# Altium project RS2-708_V010.PrjPCB (part 2 of 6)

## Sheet KSZ8795CLX.SchDoc
size A4
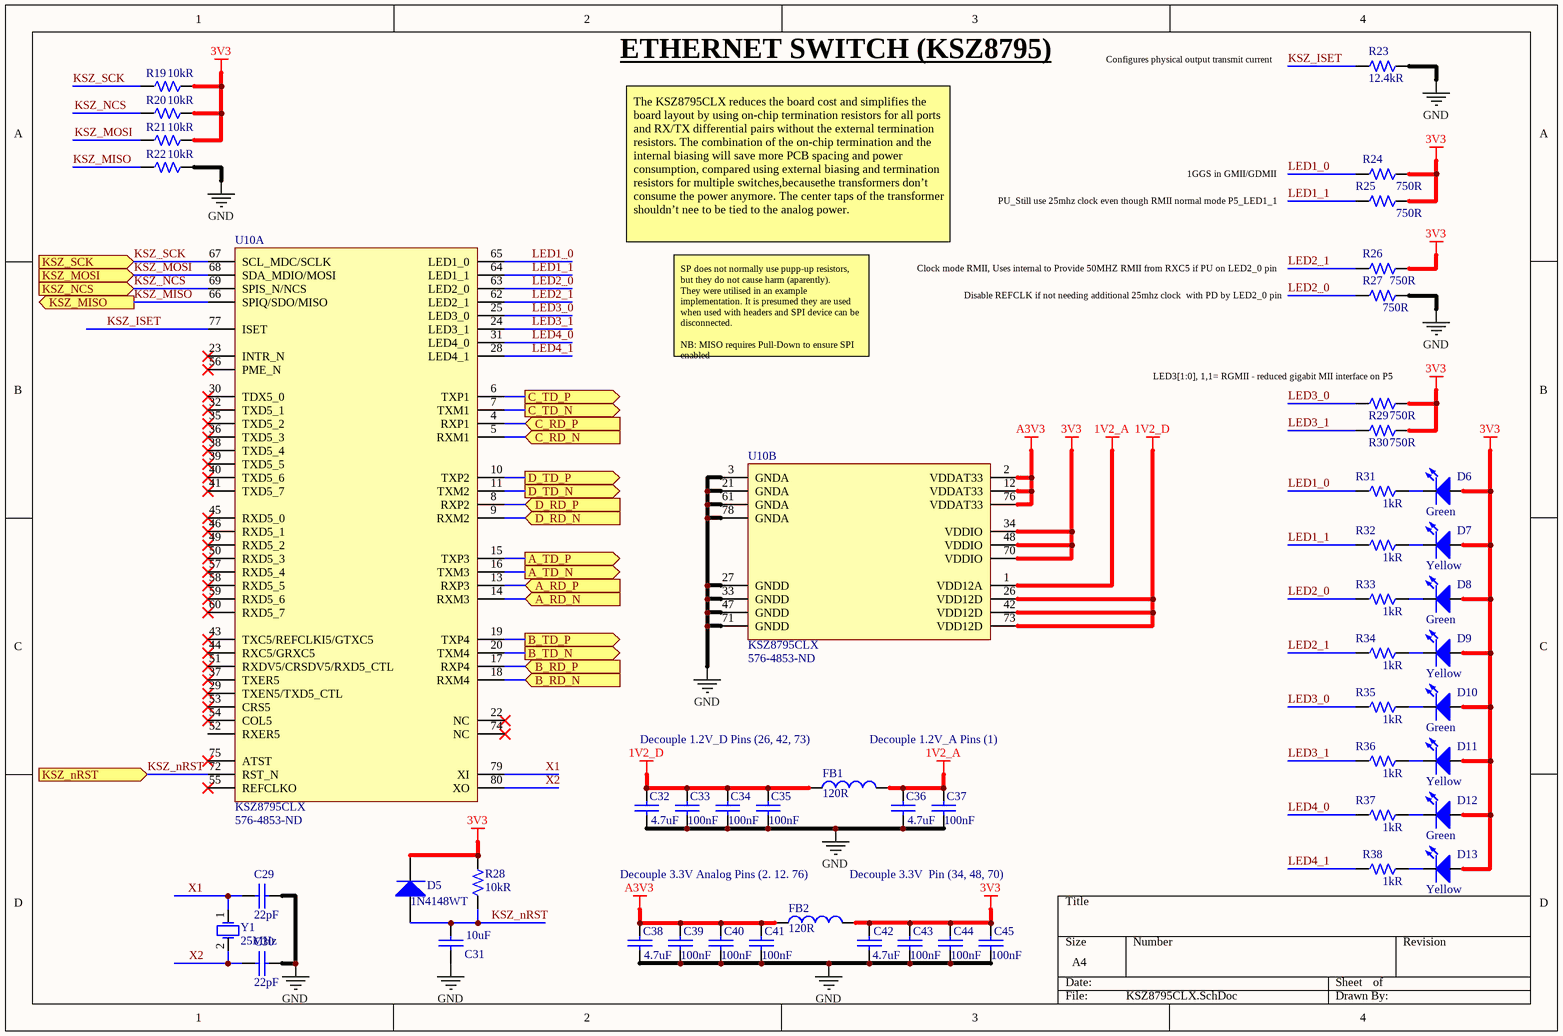
[diagram p2: KSZ8795CLX.SchDoc]

### Parts
C29  Capacitance: 22pF  [CAP0402]  (hidden comment: Capacitor)
C30  Capacitance: 22pF  [CAP0402]  (hidden comment: Capacitor)
C31  value 10uF  [CAP0603]  (hidden comment: Capacitor)
C32  Capacitance: 4.7uF  [CAP0402]  (hidden comment: Capacitor)
C33  Capacitance: 100nF  [CAP0402]  (hidden comment: Capacitor)
C34  Capacitance: 100nF  [CAP0402]  (hidden comment: Capacitor)
C35  Capacitance: 100nF  [CAP0402]  (hidden comment: Capacitor)
C36  Capacitance: 4.7uF  [CAP0402]  (hidden comment: Capacitor)
C37  Capacitance: 100nF  [CAP0402]  (hidden comment: Capacitor)
C38  Capacitance: 4.7uF  [CAP0402]  (hidden comment: Capacitor)
C39  Capacitance: 100nF  [CAP0402]  (hidden comment: Capacitor)
C40  Capacitance: 100nF  [CAP0402]  (hidden comment: Capacitor)
C41  Capacitance: 100nF  [CAP0402]  (hidden comment: Capacitor)
C42  Capacitance: 4.7uF  [CAP0402]  (hidden comment: Capacitor)
C43  Capacitance: 100nF  [CAP0402]  (hidden comment: Capacitor)
C44  Capacitance: 100nF  [CAP0402]  (hidden comment: Capacitor)
C45  Capacitance: 100nF  [CAP0402]  (hidden comment: Capacitor)
D5  Manufacturer Part Number 1: 1N4148WT  [SOD523]  (hidden comment: Diode)
D6  Color: Green  [LED-0603-GREEN]  (hidden comment: LED)
D7  Color: Yellow  [LED-0603-YELLOW]  (hidden comment: LED)
D8  Color: Green  [LED-0603-GREEN]  (hidden comment: LED)
D9  Color: Yellow  [LED-0603-YELLOW]  (hidden comment: LED)
D10  Color: Green  [LED-0603-GREEN]  (hidden comment: LED)
D11  Color: Yellow  [LED-0603-YELLOW]  (hidden comment: LED)
D12  Color: Green  [LED-0603-GREEN]  (hidden comment: LED)
D13  Color: Yellow  [LED-0603-YELLOW]  (hidden comment: LED)
FB1  Impedance: 120R  [RES0402]  (hidden comment: Ferrite Bead)
FB2  Impedance: 120R  [RES0402]  (hidden comment: Ferrite Bead)
R19  Resistance: 10kR  [RES0402]  (hidden comment: Resistor)
R20  Resistance: 10kR  [RES0402]  (hidden comment: Resistor)
R21  Resistance: 10kR  [RES0402]  (hidden comment: Resistor)
R22  Resistance: 10kR  [RES0402]  (hidden comment: Resistor)
R23  Resistance: 12.4kR  [RES0402]  (hidden comment: Resistor)
R24  Resistance: 750R  [RES0402]  (hidden comment: Resistor)
R25  Resistance: 750R  [RES0402]  (hidden comment: Resistor)
R26  Resistance: 750R  [RES0402]  (hidden comment: Resistor)
R27  Resistance: 750R  [RES0402]  (hidden comment: Resistor)
R28  Resistance: 10kR  [RES0402]  (hidden comment: Resistor)
R29  Resistance: 750R  [RES0402]  (hidden comment: Resistor)
R30  Resistance: 750R  [RES0402]  (hidden comment: Resistor)
R31  Resistance: 1kR  [RES0402]  (hidden comment: Resistor)
R32  Resistance: 1kR  [RES0402]  (hidden comment: Resistor)
R33  Resistance: 1kR  [RES0402]  (hidden comment: Resistor)
R34  Resistance: 1kR  [RES0402]  (hidden comment: Resistor)
R35  Resistance: 1kR  [RES0402]  (hidden comment: Resistor)
R36  Resistance: 1kR  [RES0402]  (hidden comment: Resistor)
R37  Resistance: 1kR  [RES0402]  (hidden comment: Resistor)
R38  Resistance: 1kR  [RES0402]  (hidden comment: Resistor)
U10  KSZ8795CLX  Supplier Part Number 1: 576-4853-ND  [KSZ8795CLX]  (parts A,B of 2)
Y1  Frequency: 25MHz  [ABM7 Oscillator]  (hidden comment: Osc)

### Ports
A_RD_N (in), A_RD_P (in), A_TD_N (out), A_TD_P (out), B_RD_N (in), B_RD_P (in), B_TD_N (out), B_TD_P (out), C_RD_N (in), C_RD_P (in), C_TD_N (out), C_TD_P (out), D_RD_N (in), D_RD_P (in), D_TD_N (out), D_TD_P (out), KSZ_MISO (out), KSZ_MOSI (in), KSZ_NCS (in), KSZ_nRST (in), KSZ_SCK (in)

### Nets
1V2_A: C36.1 C37.1 FB1.2 U10.1(VDD12A)
1V2_D: C32.1 C33.1 C34.1 C35.1 FB1.1 U10.26(VDD12D) U10.42(VDD12D) U10.73(VDD12D)
3V3: C42.1 C43.1 C44.1 C45.1 D5.1 D6.2 D7.2 D8.2 D9.2 D10.2 D11.2 D12.2 D13.2 FB2.2 R19.2 R20.2 R21.2 R24.2 R25.2 R26.2 R28.1 R29.2 R30.2 U10.34(VDDIO) U10.48(VDDIO) U10.70(VDDIO)
A3V3: C38.1 C39.1 C40.1 C41.1 FB2.1 U10.2(VDDAT33) U10.12(VDDAT33) U10.76(VDDAT33)
GND: C29.2 C30.2 C31.2 C32.2 C33.2 C34.2 C35.2 C36.2 C37.2 C38.2 C39.2 C40.2 C41.2 C42.2 C43.2 C44.2 C45.2 R22.2 R23.1 R27.2 U10.3(GNDA) U10.21(GNDA) U10.27(GNDD) U10.33(GNDD) U10.47(GNDD) U10.61(GNDA) U10.71(GNDD) U10.78(GNDA)
A_RD_N: U10.14(RXM3) ; port A_RD_N
A_RD_P: U10.13(RXP3) ; port A_RD_P
A_TD_N: U10.16(TXM3) ; port A_TD_N
A_TD_P: U10.15(TXP3) ; port A_TD_P
B_RD_N: U10.18(RXM4) ; port B_RD_N
B_RD_P: U10.17(RXP4) ; port B_RD_P
B_TD_N: U10.20(TXM4) ; port B_TD_N
B_TD_P: U10.19(TXP4) ; port B_TD_P
C_RD_N: U10.5(RXM1) ; port C_RD_N
C_RD_P: U10.4(RXP1) ; port C_RD_P
C_TD_N: U10.7(TXM1) ; port C_TD_N
C_TD_P: U10.6(TXP1) ; port C_TD_P
D_RD_N: U10.9(RXM2) ; port D_RD_N
D_RD_P: U10.8(RXP2) ; port D_RD_P
D_TD_N: U10.11(TXM2) ; port D_TD_N
D_TD_P: U10.10(TXP2) ; port D_TD_P
KSZ_ISET: R23.2 U10.77(ISET)
KSZ_MISO: R22.1 U10.66(SPIQ/SDO/MISO) ; port KSZ_MISO
KSZ_MOSI: R21.1 U10.68(SDA_MDIO/MOSI) ; port KSZ_MOSI
KSZ_NCS: R20.1 U10.69(SPIS_N/NCS) ; port KSZ_NCS
KSZ_nRST: C31.1 D5.2 R28.2 U10.72(RST_N) ; port KSZ_nRST
KSZ_SCK: R19.1 U10.67(SCL_MDC/SCLK) ; port KSZ_SCK
LED1_0: R24.1 R31.1 U10.65(LED1_0)
LED1_1: R25.1 R32.1 U10.64(LED1_1)
LED2_0: R27.1 R33.1 U10.63(LED2_0)
LED2_1: R26.1 R34.1 U10.62(LED2_1)
LED3_0: R29.1 R35.1 U10.25(LED3_0)
LED3_1: R30.1 R36.1 U10.24(LED3_1)
LED4_0: R37.1 U10.31(LED4_0)
LED4_1: R38.1 U10.28(LED4_1)
X1: C29.1 U10.79(XI) Y1.1
X2: C30.1 U10.80(XO) Y1.2
NetD6_1: D6.1 R31.2
NetD7_1: D7.1 R32.2
NetD8_1: D8.1 R33.2
NetD9_1: D9.1 R34.2
NetD10_1: D10.1 R35.2
NetD11_1: D11.1 R36.2
NetD12_1: D12.1 R37.2
NetD13_1: D13.1 R38.2

Not connected (* = marked no-connect by the designer): U10 22(NC)* 23(INTR_N)* 29(TXEN5/TXD5_CTL)* 30(TDX5_0)* 32(TXD5_1)* 35(TXD5_2)* 36(TXD5_3)* 37(TXER5)* 38(TXD5_4)* 39(TXD5_5)* 40(TXD5_6)* 41(TXD5_7)* 43(TXC5/REFCLKI5/GTXC5)* 44(RXC5/GRXC5)* 45(RXD5_0)* 46(RXD5_1)* 49(RXD5_2)* 50(RXD5_3)* 51(RXDV5/CRSDV5/RXD5_CTL)* 52(RXER5) 53(CRS5)* 54(COL5)* 55(REFCLKO)* 56(PME_N)* 57(RXD5_4)* 58(RXD5_5)* 59(RXD5_6)* 60(RXD5_7)* 74(NC)* 75(ATST)*

### Notes on the sheet
- ETHERNET SWITCH (KSZ8795)
- Configures physical output transmit current
- 1GGS in GMII/GDMII
- The KSZ8795CLX reduces the board cost and simplifies the board layout by using on-chip termination resistors for all ports and RX/TX differential pairs without the external termination resistors. The combination of the on-chip termination and the internal biasing will save more PCB spacing and power consumption, compared using external biasing and termination resistors for multiple switches,becausethe transformers don’t consume the power anymore. The center taps of the transformer shouldn’t nee to be tied to the analog power.
- PU_Still use 25mhz clock even though RMII normal mode P5_LED1_1
- Clock mode RMII, Uses internal to Provide 50MHZ RMII from RXC5 if PU on LED2_0 pin
- Disable REFCLK if not needing additional 25mhz clock  with PD by LED2_0 pin
- SP does not normally use pupp-up resistors, but they do not cause harm (aparently).
  They were utilised in an example implementation. It is presumed they are used when used with headers and SPI device can be disconnected.
  NB: MISO requires Pull-Down to ensure SPI enabled
- (near R29) LED3[1:0], 1,1= RGMII - reduced gigabit MII interface on P5
- Decouple 1.2V_D Pins (26, 42, 73)
- Decouple 1.2V_A Pins (1)
- Decouple 3.3V Analog Pins (2. 12. 76)
- Decouple 3.3V  Pin (34, 48, 70)

### Library data of the parts
C29 C30 = Capacitor: Manufacturer 1: Murata; Manufacturer Part Number 1: GRM1555C1H220FA01D; Material: Ceramic; Voltage Rating: 50V; Dielectric: C0G; Manufacturer: *; Manufacturer Part Number: *; Supplier: *; Supplier Part Number: *; Tolerance: *; Voltage: *; Footprint: *; Temperature Coefficient: *; Supplier 1: Digi-Key; Supplier Part Number 1: 490-8589-1-ND; Stock 1: 1227141; Pricing 1: 1=0,10000, 10=0,07400, 100=0,03290, 500=0,02348, 1000=0,01845, 2500=0,01678, 5000=0,01543 (USD); RoHS: Yes; Mount: Surface Mount; Case/Package: 0402; Case Code (Imperial): 0402; Case Code (Metric): 1005; Min Operating Temperature: -55°C; Max Operating Temperature: 125°C; Voltage Rating (DC): 50V; Packaging: Tape and Reel; Package Quantity: 1; Termination: SMD/SMT; Length: 1mm; Height: 0.5mm; Width: 0.5mm; Thickness: 0.022inch; Depth: 0.5mm; Radiation Hardening: No; Lead Free: Lead Free; REACH SVHC: No SVHC; ComponentLink1URL: https://datasheet.ciiva.com/11789/0900766b80ef921d-11789137.pdf?src-supplier=RSComponents; ComponentLink1Description: https://datasheet.ciiva.com/11789/0900766b80ef921d-11789137.pdf?src-supplier=RSComponents; ComponentLink2URL: https://datasheet.ciiva.com/29536/partnumbering-e-01-29536087.pdf?src-supplier=Digi-Key; ComponentLink2Description: https://datasheet.ciiva.com/29536/partnumbering-e-01-29536087.pdf?src-supplier=Digi-Key; ComponentLink3URL: https://datasheet.ciiva.com/29534/partnumbering-e-01-29534686.pdf?src-supplier=Digi-Key; ComponentLink3Description: https://datasheet.ciiva.com/29534/partnumbering-e-01-29534686.pdf?src-supplier=Digi-Key; ComponentLink4URL: https://datasheet.ciiva.com/29536/partnumbering-e-01-29536088.pdf?src-supplier=Digi-Key; ComponentLink4Description: https://datasheet.ciiva.com/29536/partnumbering-e-01-29536088.pdf?src-supplier=Digi-Key
C31 = Capacitor: Manufacturer: Murata; Manufacturer Part Number: GRM188R61E106MA73J; Voltage Rating: 25V; Tolerance: 20%; Dielectric: X5R; Supplier 1: Digi-Key; Supplier Part Number 1: 490-12737-1-ND; Stock 1: 57764; Mount: Surface Mount; Case/Package: 0603; Weight: 0.000222oz; Case Code (Metric): 1608; Case Code (Imperial): 0603; Min Operating Temperature: -55°C; Max Operating Temperature: 85°C; Packaging: Tape and Reel; Capacitance: 10uF; Termination: SMD/SMT; Composition: Ceramic; Voltage Rating (DC): 25V; Package Quantity: 10000; Length: 0.063inch; Height: 0.8mm; Width: 0.031inch; Thickness: 0.039inch; Component Type: Capacitor Ceramic
C32 C36 C38 C42 = Capacitor: Manufacturer 1: Samsung; Manufacturer Part Number 1: CL05A475MO5NUNC; Voltage Rating: 16V; Manufacturer: *; Manufacturer Part Number: *; Supplier: *; Supplier Part Number: *; Tolerance: *; Voltage: *; Footprint: *; Temperature Coefficient: *; Supplier 1: Digi-Key; Supplier Part Number 1: 1276-6836-1-ND; Stock 1: 2288634; Pricing 1: 1=0,41000, 10=0,29200, 100=0,19210, 500=0,14232, 1000=0,12097, 2500=0,11386, 5000=0,10674 (USD); RoHS: Yes; Mount: Surface Mount; Case/Package: 0402; Case Code (Metric): 1005; Case Code (Imperial): 0402; Min Operating Temperature: -55°C; Max Operating Temperature: 85°C; Packaging: Tape and Reel; Length: 0.039inch; Width: 0.02inch; Thickness: 0.022inch; ComponentLink1URL: http://www.samsungsem.com/kr/support/product-search/mlcc/CL05A475MO5NUNC.jsp?src-supplier=Digi-Key; ComponentLink1Description: http://www.samsungsem.com/kr/support/product-search/mlcc/CL05A475MO5NUNC.jsp?src-supplier=Digi-Key
C33-C35 C37 C39-C41 C43-C45 = Capacitor: Manufacturer: TDK; Manufacturer Part Number: CGA2B3X7R1H104K050BB; Voltage Rating: 50V; Tolerance: 10%; Dielectric: X7R; Supplier 1: Digi-Key; Supplier Part Number 1: 445-6899-1-ND; Stock 1: 14098587; Mount: Surface Mount; Case/Package: 0402; Weight: 2.3E-05oz; Case Code (Metric): 1005; Case Code (Imperial): 0402; Min Operating Temperature: -55°C; Max Operating Temperature: 125°C; Packaging: Tape and Reel; Package Quantity: 1; Voltage Rating (DC): 50V; Termination: SMD/SMT; Composition: Ceramic; Voltage: 50V; Length: 1mm; Height: 0.5mm; Width: 0.02inch; Thickness: 0.022inch; Depth: 0.5mm; Ratings: AEC-Q200; REACH SVHC: No SVHC; Lead Free: Lead Free; ComponentLink1URL: http://product.tdk.com/capacitor/mlcc/en/documents/mlccspec_automotive_general_midvoltage_en.pdf?src-supplier=Future+Electronics; ComponentLink1Description: http://product.tdk.com/capacitor/mlcc/en/documents/mlccspec_automotive_general_midvoltage_en.pdf?src-supplier=Future+Electronics; ComponentLink2URL: http://www.farnell.com/datasheets/1807242.pdf?src-supplier=Element14; ComponentLink2Description: http://www.farnell.com/datasheets/1807242.pdf?src-supplier=Element14; ComponentLink3URL: http://www.mouser.com/ds/2/400/lcc_automotive_general_en-843974.pdf?src-supplier=Mouser; ComponentLink3Description: http://www.mouser.com/ds/2/400/lcc_automotive_general_en-843974.pdf?src-supplier=Mouser; ComponentLink4URL: http://www.farnell.com/datasheets/1936565.pdf?src-supplier=Element14; ComponentLink4Description: http://www.farnell.com/datasheets/1936565.pdf?src-supplier=Element14; ComponentLink5URL: http://www.farnell.com/datasheets/1735392.pdf?src-supplier=Element14; ComponentLink5Description: http://www.farnell.com/datasheets/1735392.pdf?src-supplier=Element14
D5 = Diode: Manufacturer 1: ON Semiconductor / Fairchild; Recovery Time: 4ns; Element Configuration: Single; Peak Reverse Current: 5uA; Forward Current: 300mA; Average Rectified Current: 200mA; Max Repetitive Reverse Voltage (Vrrm): 75V; Forward Voltage: 1V; Max Forward Surge Current (Ifsm): 4A; Power Dissipation: 200mW; Supplier 1: Digi-Key; Supplier Part Number 1: 1N4148WTCT-ND; Stock 1: 331918; Pricing 1: 1=0,17000, 10=0,15800, 25=0,15000, 100=0,06600, 250=0,06336, 500=0,05184, 1000=0,03600, 2500=0,03144 (USD); RoHS: Yes; Mount: Surface Mount; Number of Pins: 2; Weight: 0.01g; Contact Plating: Tin,Matte; Min Operating Temperature: -55°C; Max Operating Temperature: 150°C; Package Quantity: 1; Packaging: Tape and Reel; Reverse Recovery Time: 4ns; Max Reverse Voltage (DC): 75V; Length: 1.3mm; Height: 0.7mm; Width: 0.9mm; Radiation Hardening: No; REACH SVHC: No SVHC; Lead Free: Lead Free; ComponentLink1URL: https://datasheet.ciiva.com/30479/0900766b810e1cd4-30479226.pdf?src-supplier=RSComponents; ComponentLink1Description: https://datasheet.ciiva.com/30479/0900766b810e1cd4-30479226.pdf?src-supplier=RSComponents; ComponentLink2URL: https://datasheet.ciiva.com/16744/1n4148wt-16744972.pdf?src-supplier=Future+Electronics; ComponentLink2Description: https://datasheet.ciiva.com/16744/1n4148wt-16744972.pdf?src-supplier=Future+Electronics; ComponentLink3URL: https://datasheet.ciiva.com/916/1n914bwt-916864.pdf?src-supplier=Digi-Key; ComponentLink3Description: https://datasheet.ciiva.com/916/1n914bwt-916864.pdf?src-supplier=Digi-Key; ComponentLink4URL: https://datasheet.ciiva.com/916/1n914bwt-916865.pdf?src-supplier=Digi-Key; ComponentLink4Description: https://datasheet.ciiva.com/916/1n914bwt-916865.pdf?src-supplier=Digi-Key; ComponentLink5URL: https://datasheet.ciiva.com/916/1n914bwt-916866.pdf?src-supplier=Digi-Key; ComponentLink5Description: https://datasheet.ciiva.com/916/1n914bwt-916866.pdf?src-supplier=Digi-Key; ComponentLink6URL: https://datasheet.ciiva.com/15208/getdatasheetpartid-146392-15208359.pdf?src-supplier=Verical; ComponentLink6Description: https://datasheet.ciiva.com/15208/getdatasheetpartid-146392-15208359.pdf?src-supplier=Verical
D6 D8 D10 D12 = LED: Manufacturer 1: Wurth Electronics; Manufacturer Part Number 1: 150060GS75000; Dominant Wavelength: 520nm; Test Current: 20mA; Viewing Angle: 140°; Lens Style: Clear,Rectangular; Luminous Intensity: 430mcd; Forward Current: 30mA; Forward Voltage: 3.2V; Colour: *; Supplier 1: Digi-Key; Supplier Part Number 1: 732-4971-1-ND; Stock 1: 151234; Pricing 1: 1=0,14000, 50=0,13300, 100=0,11400, 500=0,09900 (USD); RoHS: Yes; Mount: Surface Mount; Case/Package: 0603; Case Code (Imperial): 0603; Case Code (Metric): 1608; Min Operating Temperature: -40°C; Max Operating Temperature: 85°C; Wavelength: 520nm; Package Quantity: 4000; Packaging: Tape and Reel; Length: 1.6mm; Height: 0.7mm; Width: 0.8mm; REACH SVHC: Unknown; Lead Free: Lead Free; ComponentLink1URL: https://datasheet.ciiva.com/29562/150060gs75000-29562868.pdf?src-supplier=Digi-Key; ComponentLink1Description: https://datasheet.ciiva.com/29562/150060gs75000-29562868.pdf?src-supplier=Digi-Key; ComponentLink2URL: https://datasheet.ciiva.com/29279/759427-da-01-en-chipled-0603-w-kl-gruen-150060gs75000-29279201.pdf?src-supplier=Conrad; ComponentLink2Description: https://datasheet.ciiva.com/29279/759427-da-01-en-chipled-0603-w-kl-gruen-150060gs75000-29279201.pdf?src-supplier=Conrad; ComponentLink3URL: https://datasheet.ciiva.com/29562/150060gs75000-29562869.pdf?src-supplier=Digi-Key; ComponentLink3Description: https://datasheet.ciiva.com/29562/150060gs75000-29562869.pdf?src-supplier=Digi-Key; ComponentLink4URL: https://datasheet.ciiva.com/29562/150060gs75000-29562870.pdf?src-supplier=Digi-Key; ComponentLink4Description: https://datasheet.ciiva.com/29562/150060gs75000-29562870.pdf?src-supplier=Digi-Key
D7 D9 D11 D13 = LED: Manufacturer 1: Wurth Electronics; Manufacturer Part Number 1: 150060YS75000; Dominant Wavelength: 590nm; Test Current: 20mA; Viewing Angle: 140°; Lens Style: Clear,Rectangular; Luminous Intensity: 120mcd; Forward Voltage: 2V; Forward Current: 30mA; Colour: *; Supplier 1: Digi-Key; Supplier Part Number 1: 732-4981-1-ND; Stock 1: 48758; Pricing 1: 1=0,14000, 50=0,13300, 100=0,11400, 500=0,09900 (USD); RoHS: Yes; Mount: Surface Mount; Case/Package: 0603; Case Code (Imperial): 0603; Case Code (Metric): 1608; Min Operating Temperature: -40°C; Max Operating Temperature: 85°C; Package Quantity: 4000; Packaging: Tape and Reel; Wavelength: 590nm; Length: 1.6mm; Height: 0.7mm; Width: 0.8mm; REACH SVHC: Unknown; ComponentLink1URL: https://datasheet.ciiva.com/23843/150060ys75000-23843250.pdf?src-supplier=Newark; ComponentLink1Description: https://datasheet.ciiva.com/23843/150060ys75000-23843250.pdf?src-supplier=Newark; ComponentLink2URL: https://datasheet.ciiva.com/29279/759432-da-01-en-chipled-0603-w-kl-gelb-150060ys75000-29279206.pdf?src-supplier=Conrad; ComponentLink2Description: https://datasheet.ciiva.com/29279/759432-da-01-en-chipled-0603-w-kl-gelb-150060ys75000-29279206.pdf?src-supplier=Conrad; ComponentLink3URL: https://datasheet.ciiva.com/29563/150060ys75000-29563045.pdf?src-supplier=Digi-Key; ComponentLink3Description: https://datasheet.ciiva.com/29563/150060ys75000-29563045.pdf?src-supplier=Digi-Key; ComponentLink4URL: https://datasheet.ciiva.com/22656/1911348-22656951.pdf?src-supplier=Element14; ComponentLink4Description: https://datasheet.ciiva.com/22656/1911348-22656951.pdf?src-supplier=Element14; ComponentLink5URL: https://datasheet.ciiva.com/29563/150060ys75000-29563033.pdf?src-supplier=Digi-Key; ComponentLink5Description: https://datasheet.ciiva.com/29563/150060ys75000-29563033.pdf?src-supplier=Digi-Key; ComponentLink6URL: https://datasheet.ciiva.com/48430/150060ys75000-eng-tds-48430044.pdf?src-supplier=Distrelec; ComponentLink6Description: https://datasheet.ciiva.com/48430/150060ys75000-eng-tds-48430044.pdf?src-supplier=Distrelec
FB1 FB2 = Ferrite Bead: Manufacturer 1: Murata; Manufacturer Part Number 1: BLM15PD121SN1D; Material: Steel,Ferrite; Tolerance: 25%; Number of Circuits: 1; DC Resistance (DCR): 90mR; Max DC Current: 1.3A; Test Frequency: 100MHz; Supplier 1: Digi-Key; Supplier Part Number 1: 490-5203-1-ND; Stock 1: 239261; Pricing 1: 1=0,12000, 10=0,09600, 25=0,08680, 50=0,06360, 100=0,05490, 250=0,04332, 500=0,03658, 1000=0,03080, 5000=0,02743 (USD); RoHS: Yes; Case/Package: 0402; Number of Pins: 2; Core Material: Ferrite; Case Code (Metric): 1005; Case Code (Imperial): 0402; Min Operating Temperature: -55°C; Max Operating Temperature: 125°C; Package Quantity: 1; Packaging: Tape and Reel; Number of Lines: 1; Termination: SMD/SMT; DC Current: 1.3A; Military Standard: Not; Current Rating: 1.3A; Max Current Rating: 1.3A; Length: 1mm; Height: 0.5mm; Width: 0.5mm; Depth: 0.55mm; Radiation Hardening: No; Lead Free: Lead Free; REACH SVHC: No SVHC; ComponentLink1URL: https://datasheet.ciiva.com/18093/getdatasheetpartid-195858-18093157.pdf?src-supplier=Verical; ComponentLink1Description: https://datasheet.ciiva.com/18093/getdatasheetpartid-195858-18093157.pdf?src-supplier=Verical; ComponentLink2URL: https://datasheet.ciiva.com/11800/0900766b811b5866-11800860.pdf?src-supplier=RSComponents; ComponentLink2Description: https://datasheet.ciiva.com/11800/0900766b811b5866-11800860.pdf?src-supplier=RSComponents; ComponentLink3URL: https://datasheet.ciiva.com/41425/001171686-da-01-en-chip-drossel0402-120r-1300ma-1-0x0-5mm-41425776.pdf?src-supplier=Conrad; ComponentLink3Description: https://datasheet.ciiva.com/41425/001171686-da-01-en-chip-drossel0402-120r-1300ma-1-0x0-5mm-41425776.pdf?src-supplier=Conrad; ComponentLink4URL: https://datasheet.ciiva.com/41449/001172205-da-01-en-drossel-0402-120r-11-0x0-5mm-10000st-41449495.pdf?src-supplier=Conrad; ComponentLink4Description: https://datasheet.ciiva.com/41449/001172205-da-01-en-drossel-0402-120r-11-0x0-5mm-10000st-41449495.pdf?src-supplier=Conrad; ComponentLink5URL: https://datasheet.ciiva.com/1012/l0110e-1012434.pdf?src-supplier=Digi-Key; ComponentLink5Description: https://datasheet.ciiva.com/1012/l0110e-1012434.pdf?src-supplier=Digi-Key; ComponentLink6URL: https://datasheet.ciiva.com/1012/l0110e-1012435.pdf?src-supplier=Digi-Key; ComponentLink6Description: https://datasheet.ciiva.com/1012/l0110e-1012435.pdf?src-supplier=Digi-Key; ComponentLink7URL: https://datasheet.ciiva.com/1012/l0110e-1012436.pdf?src-supplier=Digi-Key; ComponentLink7Description: https://datasheet.ciiva.com/1012/l0110e-1012436.pdf?src-supplier=Digi-Key
R19-R22 R28 = Resistor: Manufacturer 1: Panasonic; Manufacturer Part Number 1: ERJ-2RKF1002X; Power Rating: 100mW; Tolerance: 1%; Voltage Rating: 50V; Temperature Coefficient: 100ppm/°C; Supplier 1: Digi-Key; Supplier Part Number 1: P10.0KLDKR-ND; Stock 1: 3290329; Pricing 1: 1=0,10000, 10=0,04100, 100=0,01680, 1000=0,00753, 2500=0,00653, 5000=0,00540 (USD); RoHS: Yes; Mount: Surface Mount; Case/Package: 0402; Number of Pins: 2; Contact Plating: Tin; Case Code (Metric): 1005; Case Code (Imperial): 0402; Min Operating Temperature: -55°C; Max Operating Temperature: 155°C; Packaging: Tape and Reel; Package Quantity: 1; Voltage Rating (DC): 50V; Features: Automotive AEC-Q200; Max Power Dissipation: 100mW; Composition: Thick Film; Number of Terminations: 2; Termination: SMD/SMT; Military Standard: Not; Length: 1mm; Height: 0.35mm; Width: 0.02inch; Depth: 0.5mm; Radiation Hardening: No; Lead Free: Lead Free; REACH SVHC: No SVHC; ComponentLink1URL: https://datasheet.ciiva.com/11821/0900766b80f80784-11821171.pdf?src-supplier=RSComponents; ComponentLink1Description: https://datasheet.ciiva.com/11821/0900766b80f80784-11821171.pdf?src-supplier=RSComponents; ComponentLink2URL: https://datasheet.ciiva.com/16199/aoa0000ce2-16199478.pdf?src-supplier=Future+Electronics; ComponentLink2Description: https://datasheet.ciiva.com/16199/aoa0000ce2-16199478.pdf?src-supplier=Future+Electronics; ComponentLink3URL: https://datasheet.ciiva.com/17212/aoa0000ce2-17212102.pdf?src-supplier=Avnet+Europe; ComponentLink3Description: https://datasheet.ciiva.com/17212/aoa0000ce2-17212102.pdf?src-supplier=Avnet+Europe; ComponentLink4URL: https://datasheet.ciiva.com/24023/aoa0000ce2-24023017.pdf?src-supplier=Mouser; ComponentLink4Description: https://datasheet.ciiva.com/24023/aoa0000ce2-24023017.pdf?src-supplier=Mouser; ComponentLink5URL: https://datasheet.ciiva.com/28514/1678782-28514185.pdf?src-supplier=Element14; ComponentLink5Description: https://datasheet.ciiva.com/28514/1678782-28514185.pdf?src-supplier=Element14; ComponentLink6URL: https://datasheet.ciiva.com/43467/1678782-43467402.pdf?src-supplier=Farnell; ComponentLink6Description: https://datasheet.ciiva.com/43467/1678782-43467402.pdf?src-supplier=Farnell; ComponentLink7URL: https://datasheet.ciiva.com/27055/1987020-27055643.pdf?src-supplier=Jameco; ComponentLink7Description: https://datasheet.ciiva.com/27055/1987020-27055643.pdf?src-supplier=Jameco; ComponentLink8URL: https://datasheet.ciiva.com/48531/aoa0000ce2-48531069.pdf?src-supplier=Avnet; ComponentLink8Description: https://datasheet.ciiva.com/48531/aoa0000ce2-48531069.pdf?src-supplier=Avnet; ComponentLink9URL: https://datasheet.ciiva.com/9194/aoa0000ce2-9194142.pdf?src-supplier=Avnet; ComponentLink9Description: https://datasheet.ciiva.com/9194/aoa0000ce2-9194142.pdf?src-supplier=Avnet; ComponentLink10URL: https://datasheet.ciiva.com/16782/70260748-16782590.pdf?src-supplier=Allied+Electronics; ComponentLink10Description: https://datasheet.ciiva.com/16782/70260748-16782590.pdf?src-supplier=Allied+Electronics; ComponentLink11URL: https://datasheet.ciiva.com/16786/70260748-16786734.pdf?src-supplier=Allied+Electronics; ComponentLink11Description: https://datasheet.ciiva.com/16786/70260748-16786734.pdf?src-supplier=Allied+Electronics; ComponentLink12URL: https://datasheet.ciiva.com/30201/aoa0000ce2-30201022.pdf?src-supplier=Onlinecomponents.com; ComponentLink12Description: https://datasheet.ciiva.com/30201/aoa0000ce2-30201022.pdf?src-supplier=Onlinecomponents.com
R23 = Resistor: Manufacturer 1: Panasonic; Manufacturer Part Number 1: ERA-2AEB1242X; Max Power Dissipation: 63mW; Temperature Coefficient: 25ppm/°C; Voltage Rating (DC): 50V; Tolerance: 0.1%; Voltage Rating: 25V; Supplier 1: Digi-Key; Supplier Part Number 1: P12.4KDCCT-ND; Stock 1: 80014; Pricing 1: 1=0,45000, 10=0,32100, 100=0,12830, 1000=0,06322, 2500=0,05858, 5000=0,05300 (USD); RoHS: Yes; Mount: Surface Mount; Case/Package: 0402; Case Code (Metric): 1005; Case Code (Imperial): 0402; Contact Plating: Tin; Min Operating Temperature: -55°C; Max Operating Temperature: 155°C; Composition: Metal Film,Thin Film; Number of Terminations: 2; Military Standard: Not; Packaging: Tape and Reel; Power Rating: 63mW; Package Quantity: 1; Features: Automotive AEC-Q200; Termination: SMD/SMT; Length: 1mm; Height: 0.016inch; Depth: 0.5mm; Width: 0.5mm; REACH SVHC: Unknown; Lead Free: Lead Free; ComponentLink1URL: https://datasheet.ciiva.com/24067/aoa0000ce26-32660-24067607.pdf?src-supplier=Mouser; ComponentLink1Description: https://datasheet.ciiva.com/24067/aoa0000ce26-32660-24067607.pdf?src-supplier=Mouser; ComponentLink2URL: https://datasheet.ciiva.com/48531/aoa0000ce26-48531851.pdf?src-supplier=Avnet; ComponentLink2Description: https://datasheet.ciiva.com/48531/aoa0000ce26-48531851.pdf?src-supplier=Avnet
R24-R27 R29 R30 = Resistor: Manufacturer 1: Panasonic; Manufacturer Part Number 1: ERJ2RKF7500X; Power Rating: 100mW; Tolerance: 1%; Voltage Rating: 50V; Temperature Coefficient: 100ppm/°C; Supplier 1: Digi-Key; Supplier Part Number 1: P750LCT-ND; Stock 1: 105501; Pricing 1: 1=0,10000, 10=0,04700, 100=0,01890, 1000=0,00851, 2500=0,00738, 5000=0,00610 (USD); RoHS: Yes; Mount: Surface Mount; Case/Package: 0402; Contact Plating: Tin; Case Code (Metric): 1005; Case Code (Imperial): 0402; Min Operating Temperature: -55°C; Max Operating Temperature: 155°C; Packaging: Tape and Reel; Voltage Rating (DC): 50V; Composition: Thick Film; Military Standard: Not; Max Power Dissipation: 100mW; Package Quantity: 10000; Number of Terminations: 2; Termination: SMD/SMT; Features: Automotive AEC-Q200; Length: 1mm; Height: 0.35mm; Depth: 0.5mm; Width: 0.02inch; REACH SVHC: No SVHC; Lead Free: Lead Free; ComponentLink1URL: https://datasheet.ciiva.com/28565/1678782-28565079.pdf?src-supplier=Element14; ComponentLink1Description: https://datasheet.ciiva.com/28565/1678782-28565079.pdf?src-supplier=Element14; ComponentLink2URL: https://datasheet.ciiva.com/9180/aoa0000ce2-9180085.pdf?src-supplier=Avnet; ComponentLink2Description: https://datasheet.ciiva.com/9180/aoa0000ce2-9180085.pdf?src-supplier=Avnet; ComponentLink3URL: https://datasheet.ciiva.com/28676/1678782-28676646.pdf?src-supplier=Element14; ComponentLink3Description: https://datasheet.ciiva.com/28676/1678782-28676646.pdf?src-supplier=Element14; ComponentLink4URL: https://datasheet.ciiva.com/30202/aoa0000ce2-30202551.pdf?src-supplier=Onlinecomponents.com; ComponentLink4Description: https://datasheet.ciiva.com/30202/aoa0000ce2-30202551.pdf?src-supplier=Onlinecomponents.com
R31-R38 = Resistor: Manufacturer 1: Panasonic; Manufacturer Part Number 1: ERJ-2GEJ102X; Temperature Coefficient: 200ppm/°C; Voltage Rating (DC): 50V; Tolerance: 5%; Power Rating: 100mW; Supplier 1: Digi-Key; Supplier Part Number 1: P1.0KJCT-ND; Stock 1: 3554258; Pricing 1: 1=0,10000, 10=0,03200, 100=0,01290, 1000=0,00578, 2500=0,00502, 5000=0,00414 (USD); RoHS: Yes; Mount: Surface Mount; Case/Package: 0402; Case Code (Metric): 1005; Case Code (Imperial): 0402; Contact Plating: Tin; Min Operating Temperature: -55°C; Max Operating Temperature: 155°C; Composition: Thick Film; Number of Terminations: 2; Termination: SMD/SMT; Military Standard: Not; Packaging: Tape and Reel; Voltage Rating: 50V; Package Quantity: 1; Features: Automotive AEC-Q200; Max Power Dissipation: 100mW; Working Voltage: 50V; Length: 1mm; Height: 0.35mm; Depth: 0.5mm; Width: 0.02inch; Radiation Hardening: No; Lead Free: Lead Free; REACH SVHC: No SVHC; ComponentLink1URL: https://datasheet.ciiva.com/11821/0900766b80f806dd-11821202.pdf?src-supplier=RSComponents; ComponentLink1Description: https://datasheet.ciiva.com/11821/0900766b80f806dd-11821202.pdf?src-supplier=RSComponents; ComponentLink2URL: https://datasheet.ciiva.com/34303/1986781-34303542.pdf?src-supplier=Jameco; ComponentLink2Description: https://datasheet.ciiva.com/34303/1986781-34303542.pdf?src-supplier=Jameco; ComponentLink3URL: https://datasheet.ciiva.com/16762/70260739-16762170.pdf?src-supplier=Allied+Electronics; ComponentLink3Description: https://datasheet.ciiva.com/16762/70260739-16762170.pdf?src-supplier=Allied+Electronics; ComponentLink4URL: https://datasheet.ciiva.com/17215/aoa0000ce1-17215306.pdf?src-supplier=Avnet+Europe; ComponentLink4Description: https://datasheet.ciiva.com/17215/aoa0000ce1-17215306.pdf?src-supplier=Avnet+Europe; ComponentLink5URL: https://datasheet.ciiva.com/43460/1500035-43460379.pdf?src-supplier=Farnell; ComponentLink5Description: https://datasheet.ciiva.com/43460/1500035-43460379.pdf?src-supplier=Farnell; ComponentLink6URL: https://datasheet.ciiva.com/16199/aoa0000ce1-16199541.pdf?src-supplier=Future+Electronics; ComponentLink6Description: https://datasheet.ciiva.com/16199/aoa0000ce1-16199541.pdf?src-supplier=Future+Electronics; ComponentLink7URL: https://datasheet.ciiva.com/30219/4aoa0000ce1-30219159.pdf?src-supplier=Onlinecomponents.com; ComponentLink7Description: https://datasheet.ciiva.com/30219/4aoa0000ce1-30219159.pdf?src-supplier=Onlinecomponents.com; ComponentLink8URL: https://datasheet.ciiva.com/22783/1500035-22783817.pdf?src-supplier=Farnell; ComponentLink8Description: https://datasheet.ciiva.com/22783/1500035-22783817.pdf?src-supplier=Farnell; ComponentLink9URL: https://datasheet.ciiva.com/48531/aoa0000ce1-48531081.pdf?src-supplier=Avnet; ComponentLink9Description: https://datasheet.ciiva.com/48531/aoa0000ce1-48531081.pdf?src-supplier=Avnet; ComponentLink10URL: https://datasheet.ciiva.com/46386/1500035-46386458.pdf?src-supplier=Element14; ComponentLink10Description: https://datasheet.ciiva.com/46386/1500035-46386458.pdf?src-supplier=Element14; ComponentLink11URL: https://datasheet.ciiva.com/16511/aoa0000ce1-16511421.pdf?src-supplier=Avnet+Asia; ComponentLink11Description: https://datasheet.ciiva.com/16511/aoa0000ce1-16511421.pdf?src-supplier=Avnet+Asia; ComponentLink12URL: https://datasheet.ciiva.com/46371/1500035-46371935.pdf?src-supplier=Element14; ComponentLink12Description: https://datasheet.ciiva.com/46371/1500035-46371935.pdf?src-supplier=Element14
U10 = KSZ8795CLX: 5Port   Ethernet Controller 10/100 Base-T/TX PHY MII, RMII Interface 80-LQFP (10x10); Manufacturer 1: Microchip; Manufacturer Part Number 1: KSZ8795CLXIC; Supplier 1: Digi-Key; Stock 1: 1232; Pricing 1: 1=5,36000, 25=4,46000, 100=4,31250 (USD); RoHS: Yes; ComponentLink1URL: http://www.mouser.com/ds/2/268/KSZ8795CLX-776186.pdf?src-supplier=Mouser; ComponentLink1Description: http://www.mouser.com/ds/2/268/KSZ8795CLX-776186.pdf?src-supplier=Mouser; ComponentLink2URL: http://www.microchip.com/mymicrochip/filehandler.aspx?ddocname=en585610&src-supplier=Digi-Key; ComponentLink2Description: http://www.microchip.com/mymicrochip/filehandler.aspx?ddocname=en585610&src-supplier=Digi-Key; ComponentLink3URL: http://www.farnell.com/datasheets/2337812.pdf?src-supplier=Newark; ComponentLink3Description: http://www.farnell.com/datasheets/2337812.pdf?src-supplier=Newark
Y1 = Crystal Oscillator: Manufacturer 1: Abracon; Manufacturer Part Number 1: ABM7-25.000MHZ-D2Y-T; ESR (Equivalent Series Resistance): 50R; Load Capacitance: 18pF; Tolerance: 20ppm; Frequency Stability: 30ppm; Supplier 1: Digi-Key; Supplier Part Number 1: 535-9847-1-ND; Stock 1: 64369; Pricing 1: 1=1,00000, 10=0,88600, 50=0,82780, 100=0,73150, 500=0,69300 (USD); RoHS: Yes; Mount: Surface Mount; Case/Package: CSMD; Number of Pins: 2; Min Operating Temperature: -40°C; Max Operating Temperature: 85°C; Package Quantity: 1000; Packaging: Tape and Reel; Frequency Tolerance: 20ppm; Termination: SMD/SMT; Composition: Ceramic; Series Resistance: 50R; Length: 6mm; Height: 0.055inch; Width: 3.3mm; Depth: 3.5mm; Radiation Hardening: No; REACH SVHC: Yes; Lead Free: Lead Free; ComponentLink1URL: https://datasheet.ciiva.com/15116/getdatasheetpartid-719821-15116724.pdf?src-supplier=Verical; ComponentLink1Description: https://datasheet.ciiva.com/15116/getdatasheetpartid-719821-15116724.pdf?src-supplier=Verical; ComponentLink2URL: https://datasheet.ciiva.com/29998/abm7-29998167.pdf?src-supplier=Avnet; ComponentLink2Description: https://datasheet.ciiva.com/29998/abm7-29998167.pdf?src-supplier=Avnet; ComponentLink3URL: https://datasheet.ciiva.com/16416/abm7-16416969.pdf?src-supplier=Future+Electronics; ComponentLink3Description: https://datasheet.ciiva.com/16416/abm7-16416969.pdf?src-supplier=Future+Electronics; ComponentLink4URL: https://datasheet.ciiva.com/1357/947971-1357275.pdf?src-supplier=Element14; ComponentLink4Description: https://datasheet.ciiva.com/1357/947971-1357275.pdf?src-supplier=Element14; ComponentLink5URL: https://datasheet.ciiva.com/18649/abm7-18649868.pdf?src-supplier=Digi-Key; ComponentLink5Description: https://datasheet.ciiva.com/18649/abm7-18649868.pdf?src-supplier=Digi-Key; ComponentLink6URL: https://datasheet.ciiva.com/18649/abm7-18649869.pdf?src-supplier=Digi-Key; ComponentLink6Description: https://datasheet.ciiva.com/18649/abm7-18649869.pdf?src-supplier=Digi-Key; ComponentLink7URL: https://datasheet.ciiva.com/18649/abm7-18649870.pdf?src-supplier=Digi-Key; ComponentLink7Description: https://datasheet.ciiva.com/18649/abm7-18649870.pdf?src-supplier=Digi-Key

## Sheet Sensors.SchDoc
size A4
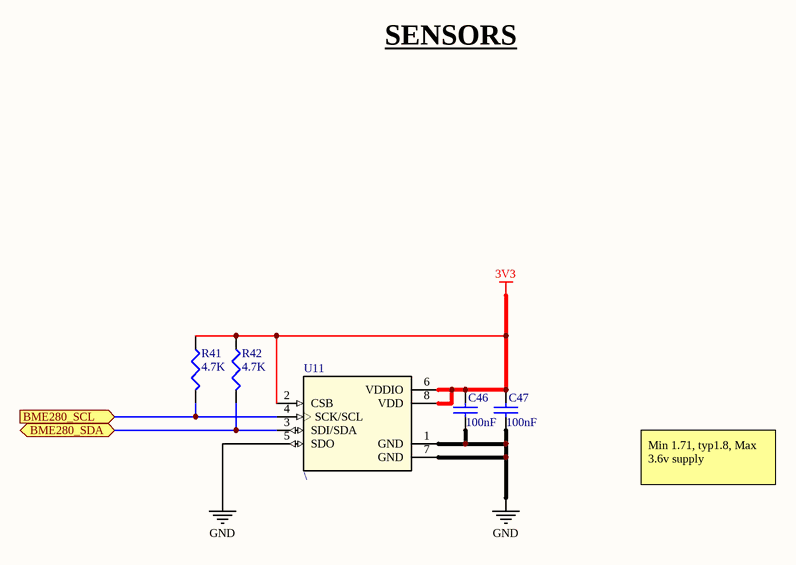
[diagram p3: Sensors.SchDoc]

### Parts
C46  Capacitance: 100nF  [CAP0402]  (hidden comment: Capacitor)
C47  Capacitance: 100nF  [CAP0402]  (hidden comment: Capacitor)
R41  value 4.7K  [RES0402]  (hidden comment: Res)
R42  value 4.7K  [RES0402]  (hidden comment: Res)
U11  \  [BME280]

### Ports
BME280_SCL (in), BME280_SDA (bidir)

### Nets
3V3: C46.1 C47.1 R41.1 R42.1 U11.2(CSB) U11.6(VDDIO) U11.8(VDD)
GND: C46.2 C47.2 U11.1(GND) U11.5(SDO) U11.7(GND)
BME280_SCL: R41.2 U11.4(SCK/SCL) ; port BME280_SCL
BME280_SDA: R42.2 U11.3(SDI/SDA) ; port BME280_SDA

### Notes on the sheet
- SENSORS
- Min 1.71, typ1.8, Max 3.6v supply

### Library data of the parts
C46 C47 = Capacitor: as C33 on sheet KSZ8795CLX; Supplier 1: Digi-Key; Supplier Part Number 1: 445-6899-1-ND; Stock 1: 14098587; Mount: Surface Mount; Case/Package: 0402; Weight: 2.3E-05oz; Case Code (Metric): 1005; Case Code (Imperial): 0402; Min Operating Temperature: -55°C; Max Operating Temperature: 125°C; Packaging: Tape and Reel; Package Quantity: 1; Voltage Rating (DC): 50V; Termination: SMD/SMT; Composition: Ceramic; Voltage: 50V; Length: 1mm; Height: 0.5mm; Width: 0.02inch; Thickness: 0.022inch; Depth: 0.5mm; Ratings: AEC-Q200; REACH SVHC: No SVHC; Lead Free: Lead Free; ComponentLink1URL: http://product.tdk.com/capacitor/mlcc/en/documents/mlccspec_automotive_general_midvoltage_en.pdf?src-supplier=Future+Electronics; ComponentLink1Description: http://product.tdk.com/capacitor/mlcc/en/documents/mlccspec_automotive_general_midvoltage_en.pdf?src-supplier=Future+Electronics; ComponentLink2URL: http://www.farnell.com/datasheets/1807242.pdf?src-supplier=Element14; ComponentLink2Description: http://www.farnell.com/datasheets/1807242.pdf?src-supplier=Element14; ComponentLink3URL: http://www.mouser.com/ds/2/400/lcc_automotive_general_en-843974.pdf?src-supplier=Mouser; ComponentLink3Description: http://www.mouser.com/ds/2/400/lcc_automotive_general_en-843974.pdf?src-supplier=Mouser; ComponentLink4URL: http://www.farnell.com/datasheets/1936565.pdf?src-supplier=Element14; ComponentLink4Description: http://www.farnell.com/datasheets/1936565.pdf?src-supplier=Element14; ComponentLink5URL: http://www.farnell.com/datasheets/1735392.pdf?src-supplier=Element14; ComponentLink5Description: http://www.farnell.com/datasheets/1735392.pdf?src-supplier=Element14
R41 R42 = Resistor: Manufacturer: Yageo; Manufacturer Part Number: RC0402FR-074K7L; Power Rating: 0.063W; Tolerance: 1%; Component Type: Resistor; Price: 0.14; Supplier: Digikey; Supplier Part Number: 311-4.7KLRCT-ND; Footprint: 0402
U11 = BME280: Bosch Temp, Hum, Abs Pressure Environmental Sensor; Sensor Type: Temperature; Output Type: SPI,I2C; Accuracy: 3%; Response Time: 1s; Supplier 1: Digi-Key; Manufacturer 1: Bosch; Manufacturer Part Number 1: BME280; Stock 1: 18369; Pricing 1: 1=6,55000, 5=5,77600, 10=5,10100, 25=4,13880, 50=3,65760, 100=3,56130, 500=2,98376, 1000=2,79126, 5000=2,59876 (USD); RoHS: No; Mount: Surface Mount; Case/Package: LGA; Number of Pins: 8; Min Operating Temperature: -40°C; Max Operating Temperature: 85°C; Packaging: Cut Tape; Lead Free: Lead Free; ComponentLink1URL: https://ae-bst.resource.bosch.com/media/_tech/media/datasheets/BST-BME280-DS002.pdf?src-supplier=Digi-Key; ComponentLink1Description: https://ae-bst.resource.bosch.com/media/_tech/media/datasheets/BST-BME280-DS002.pdf?src-supplier=Digi-Key; ComponentLink2URL: https://ae-bst.resource.bosch.com/media/_tech/media/product_flyer/BME280_Productflyer_BST_20170109.pdf?src-supplier=Arrow; ComponentLink2Description: https://ae-bst.resource.bosch.com/media/_tech/media/product_flyer/BME280_Productflyer_BST_20170109.pdf?src-supplier=Arrow; ComponentLink3URL: https://ae-bst.resource.bosch.com/media/_tech/media/product_flyer/BME280_Productflyer_BST_20170109.pdf?src-supplier=Mouser; ComponentLink3Description: https://ae-bst.resource.bosch.com/media/_tech/media/product_flyer/BME280_Productflyer_BST_20170109.pdf?src-supplier=Mouser; ComponentLink4URL: https://ae-bst.resource.bosch.com/media/_tech/media/product_flyer/BME280_Productflyer_BST_20170109.pdf?src-supplier=NAC+Semi; ComponentLink4Description: https://ae-bst.resource.bosch.com/media/_tech/media/product_flyer/BME280_Productflyer_BST_20170109.pdf?src-supplier=NAC+Semi; Supplier Part Number 1: 828-1063-1-ND